# EAGLE design lun1k_v1_2 (EAGLE 6.6.0)
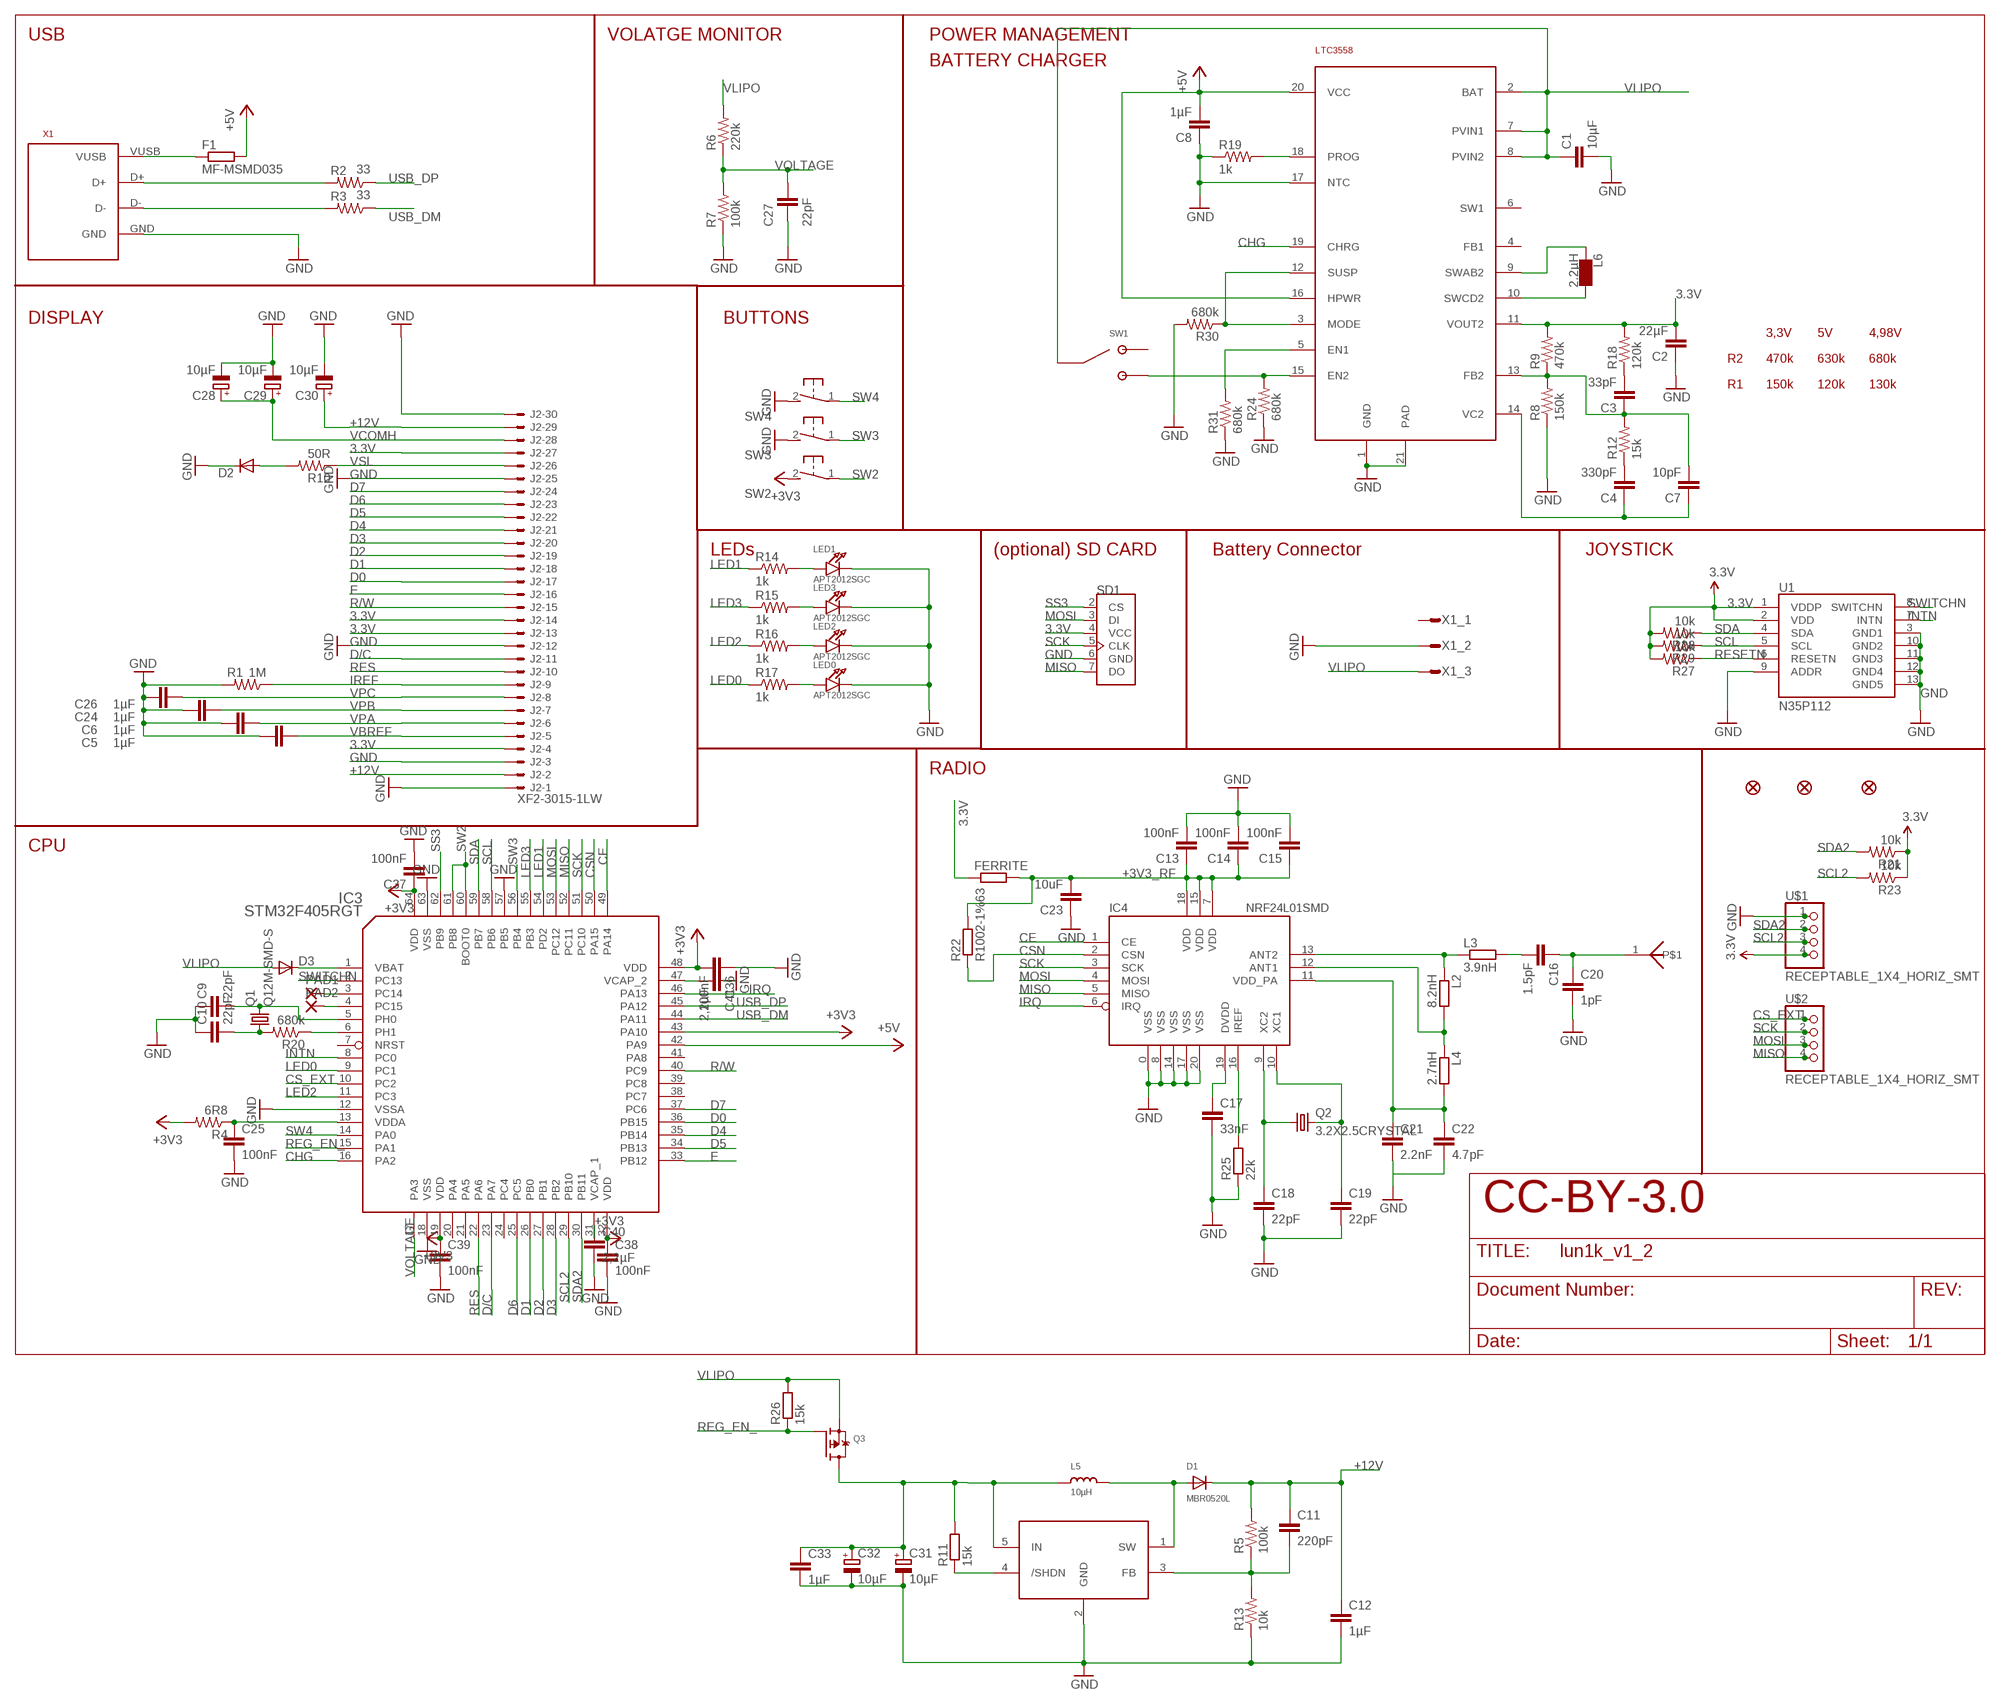
[diagram p0: schematic, sheet 1]

## Parts
ANT  CHIPANTENNA  [CHIPANTENNA]
C1  10µF  CAP0805  [0805]
C2  22µF  CAP0805  [0805]
C3  33pF  CAP0805  [0805]
C4  330pF  CAP0805  [0805]
C5  1µF  CAP0805  [0805]
C6  1µF  CAP0805  [0805]
C7  10pF  CAP0805  [0805]
C8  1µF  CAP0805  [0805]
C9  22pF  CAP0402-CAP  [0402-CAP]
C10  22pF  CAP0402-CAP  [0402-CAP]
C11  220pF  CAP0805  [0805]
C12  1µF  CAP0805  [0805]
C13  100nF  C-EUC0402K  [C0402K]
C14  100nF  C-EUC0402K  [C0402K]
C15  100nF  C-EUC0402K  [C0402K]
C16  1.5pF  C-EUC0402K  [C0402K]
C17  33nF  C-EUC0402K  [C0402K]
C18  22pF  C-EUC0402K  [C0402K]
C19  22pF  C-EUC0402K  [C0402K]
C20  1pF  C-EUC0402K  [C0402K]
C21  2.2nF  C-EUC0402K  [C0402K]
C22  4.7pF  C-EUC0402K  [C0402K]
C23  10uF  C-EUC0805K  [C0805K]
C24  1µF  CAP0805  [0805]
C25  100nF  CAP0402-CAP  [0402-CAP]
C26  1µF  CAP0805  [0805]
C27  22pF  CAP0402-CAP  [0402-CAP]
C28  10µF  CPOL-EUSMCA  [SMC_A]
C29  10µF  CPOL-EUSMCA  [SMC_A]
C30  10µF  CPOL-EUSMCA  [SMC_A]
C31  10µF  CPOL-EUSMCA  [SMC_A]
C32  10µF  CPOL-EUSMCA  [SMC_A]
C33  1µF  CAP0805  [0805]
C36  100nF  CAP0402-CAP  [0402-CAP]
C37  100nF  CAP0402-CAP  [0402-CAP]
C38  100nF  CAP0402-CAP  [0402-CAP]
C39  100nF  CAP0402-CAP  [0402-CAP]
C40  2,2µF  CAP0805  [0805]
C41  2,2µF  CAP0805  [0805]
D1  MBR0520L  DIODESOD-123  [SOD-123]
D2  DIODE-SOD323-R  [SOD323-R]
D3  DIODE-SOD323-R  [SOD323-R]
F1  MF-MSMD035  R-EU_R1210  [R1210]
FERRITE  R-EU_R0805  [R0805]
FID1  FIDUCIAL1.5X3  [FIDUCIAL-1.5X3]
FID2  FIDUCIAL1.5X3  [FIDUCIAL-1.5X3]
FID3  FIDUCIAL1.5X3  [FIDUCIAL-1.5X3]
IC1  LTC3558  [UD-QFN20]
IC2  LM27313  [SOT23-5L]
IC3  STM32F405RGT  [LQFP64]
IC4  NRF24L01SMD  [QFN20]
J2  XF2-3015-1LW  [XF2H-3015-1LW]
L2  8.2nH  R-EU_R0402  [R0402]
L3  3.9nH  R-EU_R0402  [R0402]
L4  2.7nH  R-EU_R0402  [R0402]
L5  10µH  INDUCTOR  [INDUCTOR_1007]
L6  2.2µH  CDH3D16  [CDRH3D16]
LED0  APT2012SGC  LED0805  [CHIPLED_0805]
LED1  APT2012SGC  LED0805  [CHIPLED_0805]
LED2  APT2012SGC  LED0805  [CHIPLED_0805]
LED3  APT2012SGC  LED0805  [CHIPLED_0805]
PAD1  SMD2  [SMD1,27-2,54]
PAD2  SMD2  [SMD1,27-2,54]
Q1  Q12M-SMD-S  X22-OSCILLATOR  [X22]
Q2  3.2X2.5CRYSTAL  [CRYSTAL3.2X2.5]
Q3  MOSFET-P  [SOT23-R]
R1  1M  RESISTOR0805-RES  [0805]
R2  33  RESISTOR0402-RES  [0402-RES]
R3  33  RESISTOR0402-RES  [0402-RES]
R4  6R8  RESISTOR0402-RES  [0402-RES]
R5  100k  RESISTOR0805-RES  [0805]
R6  220k  RESISTOR0402-RES  [0402-RES]
R7  100k  RESISTOR0402-RES  [0402-RES]
R8  150k  RESISTOR0805-RES  [0805]
R9  470k  RESISTOR0805-RES  [0805]
R10  50R  RESISTOR0805-RES  [0805]
R11  15k  R-EU_R0402  [R0402]
R12  15k  RESISTOR0805-RES  [0805]
R13  10k  RESISTOR0805-RES  [0805]
R14  1k  RESISTOR0402-RES  [0402-RES]
R15  1k  RESISTOR0402-RES  [0402-RES]
R16  1k  RESISTOR0402-RES  [0402-RES]
R17  1k  RESISTOR0402-RES  [0402-RES]
R18  120k  RESISTOR0805-RES  [0805]
R19  1k  RESISTOR0805-RES  [0805]
R20  680k  RESISTOR0402-RES  [0402-RES]
R21  10k  RESISTOR0402-RES  [0402-RES]
R22  R1002-1%63  R-EU_R0603  [R0603]
R23  10k  RESISTOR0402-RES  [0402-RES]
R24  680k  RESISTOR0402-RES  [0402-RES]
R25  22k  R-EU_R0603  [R0603]
R26  15k  R-EU_R0402  [R0402]
R27  10k  RESISTOR0402-RES  [0402-RES]
R28  10k  RESISTOR0402-RES  [0402-RES]
R29  10k  RESISTOR0402-RES  [0402-RES]
R30  680k  RESISTOR0402-RES  [0402-RES]
R31  680k  RESISTOR0402-RES  [0402-RES]
SD1  MICROSD_SF-MICROSD  [MICROSD_MICROSD]
SW1  JS102011SAQN  [JS102011SAQN]
SW2  SWITCH_MCTAEF  [SWITCH_MCTAEF]
SW3  SWITCH_MCTAEF  [SWITCH_MCTAEF]
SW4  SWITCH_MCTAEF  [SWITCH_MCTAEF]
U1  N35P112  [N35P112]
U$1  RECEPTABLE_1X4_HORIZ_SMT  [RECEPTABLE_1X4_HORIZ_SMT]
U$2  RECEPTABLE_1X4_HORIZ_SMT  [RECEPTABLE_1X4_HORIZ_SMT]
X1  MICROUSB  [MICROAB]
X1_  JST-PH3  [JST-PH3]

## Nets
3.3V [GND/3V3]: C2.2 C36.2 C37.1 C38.1 C39.1 FERRITE.1 IC1.11(VOUT2) IC3.19(VDD) IC3.32(VDD) IC3.43(PA10) IC3.48(VDD) IC3.64(VDD) J2.4 J2.13 J2.14 J2.27 R4.2 R9.2 R18.2 R21.1 R23.1 R27.2 R28.2 R29.2 SD1.4(VCC) SW2.2 U1.1(VDDP) U1.2(VDD) U$1.4 U$1.4@1 ; supply symbol labelled +3V3
+3V3_RF: C13.1 C14.1 C15.1 C23.2 FERRITE.2 IC4.7(VDD) IC4.15(VDD) IC4.18(VDD) R22.2
+5V [FAT]: C8.2 F1.2 IC1.16(HPWR) IC1.20(VCC) IC3.42(PA9)
+12V: C11.1 C12.1 C30.+ D1.C J2.2 J2.29 R5.2
CE: IC3.49(PA14) IC4.1(CE)
CHG: IC1.19(CHRG) IC3.16(PA2)
CS_EXT: IC3.10(PC2) U$2.1 U$2.1@1
CSN: IC3.50(PA15) IC4.2(CSN) R22.1
D0: IC3.36(PB15) J2.17
D1: IC3.26(PB0) J2.18
D2: IC3.27(PB1) J2.19
D3: IC3.28(PB2) J2.20
D4: IC3.35(PB14) J2.21
D5: IC3.34(PB13) J2.22
D6: IC3.25(PC5) J2.23
D7: IC3.37(PC6) J2.24
D+: R2.2 X1.D+
D-: R3.2 X1.D-
D/C: IC3.23(PA7) J2.11
E [GND/3V3]: IC3.33(PB12) J2.16
EN2: IC1.15(EN2) R24.2 SW1.3
GND [GND/3V3]: C1.2 C2.1 C5.1 C6.1 C8.1 C9.1 C10.1 C12.2 C13.2 C14.2 C15.2 C17.2 C18.2 C19.2 C20.2 C21.2 C22.2 C23.1 C24.1 C25.2 C26.1 C27.1 C28.- C29.- C30.- C31.- C32.- C33.2 C36.1 C37.2 C38.2 C39.2 C40.2 C41.1 D2.C IC1.1(GND) IC1.17(NTC) IC1.21(PAD) IC2.2(GND) IC3.12(VSSA) IC3.18(VSS) IC3.57(PB5) IC3.63(VSS) IC4.0(VSS) IC4.8(VSS) IC4.14(VSS) IC4.17(VSS) IC4.20(VSS) J2.1 J2.3 J2.12 J2.25 J2.30 LED0.C LED1.C LED2.C LED3.C R1.2 R7.1 R8.1 R13.1 R19.1 R24.1 R25.1 R30.2 R31.1 SD1.6(GND) SW3.2 SW4.2 U1.3(GND1) U1.9(ADDR) U1.10(GND2) U1.11(GND3) U1.12(GND4) U1.13(GND5) U$1.1 U$1.1@1 X1.GND X1_.2
INTN: IC3.8(PC0) U1.7(INTN)
IREF: J2.9 R1.1
IRQ: IC3.46(PA13) IC4.6(IRQ)
LED0: IC3.9(PC1) R17.1
LED1: IC3.54(PD2) R14.1
LED2: IC3.11(PC3) R16.1
LED3: IC3.55(PB3) R15.1
MISO: IC3.52(PC11) IC4.5(MISO) SD1.7(DO) U$2.4 U$2.4@1
MOSI: IC3.53(PC12) IC4.4(MOSI) SD1.3(DI) U$2.3 U$2.3@1
N$1: C9.2 IC3.5(PH0) Q1.3
N$2: IC1.18(PROG) R19.2
N$3: C10.2 Q1.1 R20.2
N$4: LED0.A R17.2
N$5: LED2.A R16.2
N$6: LED3.A R15.2
N$7: C3.1 C7.2 IC1.13(FB2) R8.2 R9.1 R12.2
N$8: F1.1 X1.VUSB
N$9: LED1.A R14.2
N$10: C18.1 IC4.9(XC2) Q2.1
N$11: C19.1 IC4.10(XC1) Q2.3
N$12 [GND/3V3]: ANT.1 C16.1 C20.1
N$13: C3.2 R18.1
N$14: D2.A R10.2
N$15: C25.1 IC3.13(VDDA) R4.1
N$16: C4.2 R12.1
N$17: C4.1 C7.1 IC1.14(VC2)
N$18: IC1.10(SWCD2) L6.P$1
N$19: C40.1 IC3.31(VCAP_1)
N$20: C41.2 IC3.47(VCAP_2)
N$21: IC3.3(PC14) PAD1.1(P)
N$22: IC1.9(SWAB2) L6.P$2
N$23: IC3.4(PC15) PAD2.1(P)
N$24: D1.A IC2.1(SW) L5.P$2
N$25: IC1.3(MODE) IC1.12(SUSP) R30.1
N$26: C11.2 IC2.3(FB) R5.1 R13.2
N$27: IC1.5(EN1) R31.2
N$28: IC3.6(PH1) R20.1
N$29: D3.C IC3.1(VBAT)
N$30: IC2.4(/SHDN) R11.1
N$70: C17.1 IC4.19(DVDD)
N$71: IC4.16(IREF) R25.2
N$73: C21.1 C22.1 IC4.11(VDD_PA) L4.2
N$78: IC4.12(ANT1) L2.2 L4.1
N$79: IC4.13(ANT2) L2.1 L3.1
N$80: C16.2 L3.2
R/W [GND/3V3]: IC3.40(PC9) J2.15
REG_EN_: IC3.15(PA1) Q3.1(G) R26.1
RES: IC3.22(PA6) J2.10
RESETN: R27.1 U1.6(RESETN)
SCK: IC3.51(PC10) IC4.3(SCK) SD1.5(CLK) U$2.2 U$2.2@1
SCL: IC3.58(PB6) R29.1 U1.5(SCL)
SCL2: IC3.29(PB10) R23.2 U$1.3 U$1.3@1
SDA: IC3.59(PB7) R28.1 U1.4(SDA)
SDA2: IC3.30(PB11) R21.2 U$1.2 U$1.2@1
SS3: IC3.62(PB9) SD1.2(CS)
SW2: IC3.60(BOOT0) IC3.61(PB8) SW2.1
SW3: IC3.56(PB4) SW3.1
SW4: IC3.14(PA0) SW4.1
SWITCHN: IC3.2(PC13) U1.8(SWITCHN)
USB_DM: IC3.44(PA11) R3.1
USB_DP: IC3.45(PA12) R2.1
VBREF: C5.2 J2.5
VCOMH: C28.+ C29.+ J2.28
VLIPO: C1.1 D3.A IC1.2(BAT) IC1.7(PVIN1) IC1.8(PVIN2) Q3.2(S) R6.2 R26.2 SW1.2 X1_.3
VOLTAGE: C27.2 IC3.17(PA3) R6.1 R7.2
VPA: C6.2 J2.6
VPB: C24.2 J2.7
VPC: C26.2 J2.8
VREGIN: C31.+ C32.+ C33.1 IC2.5(IN) L5.P$1 Q3.3(D) R11.2
VSL: J2.26 R10.1
Unconnected: IC1.4(FB1) IC1.6(SW1) IC3.7(NRST) IC3.20(PA4) IC3.21(PA5) IC3.24(PC4) IC3.38(PC7) IC3.39(PC8) IC3.41(PA8) SW1.1 X1_.1

## Notes on the sheet
- USB | VOLATGE MONITOR | POWER MANAGEMENT
- BATTERY CHARGER
- DISPLAY | BUTTONS
- 3,3V | 5V | 4,98V
- R2 | 470k | 630k | 680k
- R1 | 150k | 120k | 130k
- LEDs | (optional) SD CARD | Battery Connector | JOYSTICK
- RADIO
- CPU
- CC-BY-3.0

## Library data of the parts
ANT = badge:CHIPANTENNA
C1-C8 C11 C12 C24 C26 C33 C40 C41 = SparkFun:CAP: Capacitor Standard 0603 ceramic capacitor, and 0.1" leaded capacitor.
C9 C10 C25 C27 C36-C39 = SparkFun-Capacitors:CAP: Capacitor Standard 0603 ceramic capacitor, and 0.1" leaded capacitor.
C13-C23 = rcl:C-EU: CAPACITOR, European symbol
C28-C32 = rcl:CPOL-EU: POLARIZED CAPACITOR, European symbol
D1 = microbuilder:DIODE: Diode SMA Model Volts Amps Type Vf Vr Digikey # Notes SSA34-E3 40V 3A Schottky 480mV @ 3A 200uA @ 40V SSA34-E3/61TGITR-ND CDBA120-G 20V 1A Schottky 500mV @ 1A 500uA @ 20V 641-1014-6-ND REEL MBRA210 10V 2A Schottky 350mV @ 2A 700uA @ 10V MBRA210LT3 SOD-123 Model Volts Amps Type Vf Vr Order # Notes BAT54T1G 30V 200mA Schottky 800mV @ 200mA 2uA @ 25V BAT54T1GOSTR-ND B0530W 30V 500mA Schottky 430mV @ 500mA 130uA @ 30V B0530W-FDICT-ND REEL MBR120 1A 20V Schottky 340mV @ 1A MBR120VLSFT1GOSCT-ND SOD-323 Model Volts Amps Type Vf Vr Order # Notes PMEG2005EJ 20V 500mA Schottky 355mV @ 500mA 568-4110-1-ND ZLLS410 10V 570mA Schottky 380mV @ 570mA ZLLS410CT-ND 1N4148WS 75V 150mA Silicon/Simple 1V 1N4148WSFSCT-ND REEL SOD-523 Model Volts Amps Type Vf Vr Order # Notes BAT54XV2 30V 200mA Schottky 0.8V @ 100mA BAT54XV2CT-ND TB751S 30V 30mA Schottky RB751S-40TE61CT-ND SOT23-R/W (R = Solder Paste/Reflow Ovens, W = Hand-Soldering) Model Volts Amps Type Vf Vr Order # Notes BAT54FILM 40V 300mA Schottky 497-7162-1-ND
D2 D3 = diode:DIODE-: DIODE
F1 FERRITE L2-L4 R11 R22 R25 R26 = rcl:R-EU_: RESISTOR, European symbol
FID1-FID3 = SparkFun:FIDUCIAL: Fiducial Alignment Points Various fiducial points for machine vision alignment.
IC1 = seb:LTC3558
IC2 = seb:LM27313
IC3 = stm32:STM32F405R*T: STM32F405R*T ARM Cortex-M4 32b MCU+FPU, 210DMIPS, up to 1MB Flash/192+4KB RAM, USB OTG HS/FS, 17 TIMs, 3 ADCs, 15 comm.
IC4 = SparkFun:NRF24L01: 2.4GHz Low Power Transceiver This is the very popular, low cost, very low power RF transceiver from Nordic Semiconductor. Simple SPI interface. SKU: COM-00690
J2 = con-omron:XF2*-30?: OMRON FPC Connector Source : http://www.omron.com/ecb/products/pdf/fpc.pdf; OC_FARNELL: 1112560; OC_NEWARK: unknown
L5 = microbuilder:INDUCTOR: Inductors 0603: 10nH Ceramic Inductor - microwire antenna/RF (Digikey: 712-1434-2-ND) 0805: 560nH Ceramic Inductor - RF (Digikey: 553-1047-1-ND) 270nH Ceramic Inductor - Q = 40@250MHz, +-5%, 1 Ohm DC Resistance (Digikey: 535-10506-2-ND) 1007 (2518 Metric) SMT: 10µH 10% 250mOhm 820mA 1007 Inductor (Digikey: 587-2189-1-ND) 22µH 10% 500mOhm 580mA 1007 Inductor (Digikey: 587-2190-1-ND) 47µH 10% 950mOhm 420mA 1007 Inductor (Digikey: 587-2191-1-ND) 47µH 5% 100mOhm 1A 1008 Inductor (Digikey: 732-1816-1-ND) 5.0x5.0mm (Taiyo Yuden NR5040 Series) 6.8µH 20% 2.3A 64mOhm Inductor (Digikey: 587-2374-2-ND) 5.0x5.0mm (TDK VLC5045 Series) 4.7µH 20% 3.3A 34mOhm Inductor (Digikey: 445-6526-1-ND) 6.8µH 20% 2.7A 46mOhm Inductor (Digikey: 445-6527-1-ND) 6.0x6.0mm (TDK VLC6045 Series) 4.7µH 20% 3.8A 27mOhm Inductor (Digikey: 445-6538-2-ND) 6.8µH 20% 3A 41mOhm Inductor (Digikey: 445-6540-1-ND) 6.2µH 30% 2.2A 45mOhm Inductor (Digikey: SRR5028-6R2YCT-ND) - Not TDK VLC6045 but footprint should match 6.0x6.0mm (TDK SLF6045 Series) 6.8uH 30% 2A 33mOhm Inductor (Digikey: 445-4572-1-ND, Mouser: 810-SLF645T6R8N2R0PF)
L6 = seb:CDH3D16
LED0 LED1-LED3 = microbuilder:LED: LED 0603 - 0603 Surface Mount Package 2mA: Green LED - Low Power (3.9mcd, 2ma, 1.7Vf) - Digikey: 475-2709-2-ND Orange LED - Low Power (9.8mcd, 2ma, 1.8Vf) - Digikey: 475-1194-2-ND Red LED - Low Power (5mcd, 2ma, 1.8Vf) - Digikey: 475-1195-2-ND Yellow LED - Low Power (7mcd, 2ma, 1.8Vf) - Digikey: 475-1196-2-ND 5mA: Blue LED - Low Power (17mcd, 5ma, 2.9Vf) - Digikey: LNJ937W8CRACT-ND 0805 - 0805 Surface Mount Package 2mA: Red LED (8.8mcd, 2mA, 1.8Vf, Clear) - Low Power [Digikey: 475-2510-1-ND] Green LED (5mcd, 2mA, 1.8Vf, Clear) - Low Power [Digikey: 475-2730-1-ND] Yellow LED (11.3mcd, 2mA, 1.8Vf, Clear) - Low Power [Digikey: 475-2555-1-ND] 20mA: Red LED (104mcd, 20mA, Diffused) - LS R976 [Digikey: 475-1278-6-ND] Red LED (12mcd, 20mA, 2.0Vf, Clear) - APT2012EC [Digikey: 754-1128-1-ND] Green LED (15mcd, 20mA, 2.2Vf, Clear) - APT2012GC [Digikey: 754-1131-1-ND] Orange LED (160mcd, 20mA, 2.1Vf, Clear) - APT2012SECK [Digikey: 754-1130-1-ND] 1206 - 1206 Surface Mount Package Green LED (26mcd, 20mA, Diffused) - LG N971 [Digikey: 475-1407-6-ND] Red LED (15mcd, 20mA, Diffused) - LH N974 [Digikey: 475-1416-6-ND]
PAD1 PAD2 = wirepad:SMD2: SMD PAD
Q1 = seb:X22-OSCILLATOR
Q2 = badge:3.2X2.5CRYSTAL
Q3 = microbuilder:MOSFET-P: P-Channel Mosfet LEGEND VDS: Voltage Drain-Source ID: Drain Current RDS(ON): Drain-Source On-State Resistance VGS(TH): Gate-Source Threshold Voltage CISS: Drain-Source Input Capacitance SOT-23 Name VDS ID RDS(ON) VGS(TH) CISS Order Number IRLML5103 30V 760mA 600 mOhm -- 75pF @ 25V Digikey: IRLML5103PBFCT-ND IRLML6401 12V 4.3A 50 mOhm 950mV @ 250µA 830pF @ 10V Digikey: IRLML6401PBFTR-ND NTR0202PL 20V 400mA 800 mOhm 2.3V @ 250uA 70pF @ 5V Digikey: NTR0202PLT1GOSTR-ND NTR4101PT1G 20V 1.8A 85 mOhm 1.2V @ 250uA 675pF @ 10V Digikey: NTR4101PT1GOSCT-ND DMP2004K 20V 600mA 900 mOhm 1V @ 250uA 175pF @ 16V Digikey: DMP2004KDICT-ND PMV65XP 20V 3.9A 76 mOhm 950mV @ 1mA 725pF @ 20V Digikey: 568-2358-2-ND TO-252 Name VDS ID RDS(ON) VGS(TH) CISS Order Number AOD417 30V 25A 34 mOhm 3V @ 250µA 920pF @ 15V Digikey: 785-1106-2-ND
R1 R5 R10 R13 R21 R23 R27-R29 = SparkFun:RESISTOR: Resistor Basic schematic elements and footprints for 0603, 1206, and PTH resistors.
R2 R3 R6 R7 R14-R17 = SparkFun-Passives:RESISTOR: Resistor Basic schematic elements and footprints for 0603, 1206, and PTH resistors.
R4 R8 R9 R12 R18-R20 R24 R30 R31 = SparkFun-Resistors:RESISTOR: Resistor Basic schematic elements and footprints for 0603, 1206, and PTH resistors.
SD1 = sd:MICROSD_SF-MICROSD
SW1 = badge:JS102011SAQN
SW2-SW4 = seb:SWITCH_MCTAEF
U1 = miscellany:N35P112
U$1 U$2 = seb:RECEPTABLE_1X4_HORIZ_SMT
X1 = badge:MICROUSB
X1_ = badge:JST-PH3

## Net classes
1 FAT: width 0.2 mm, drill 0.4 mm
2 GND/3V3: width 0.2 mm, drill 0.4 mm

## Board
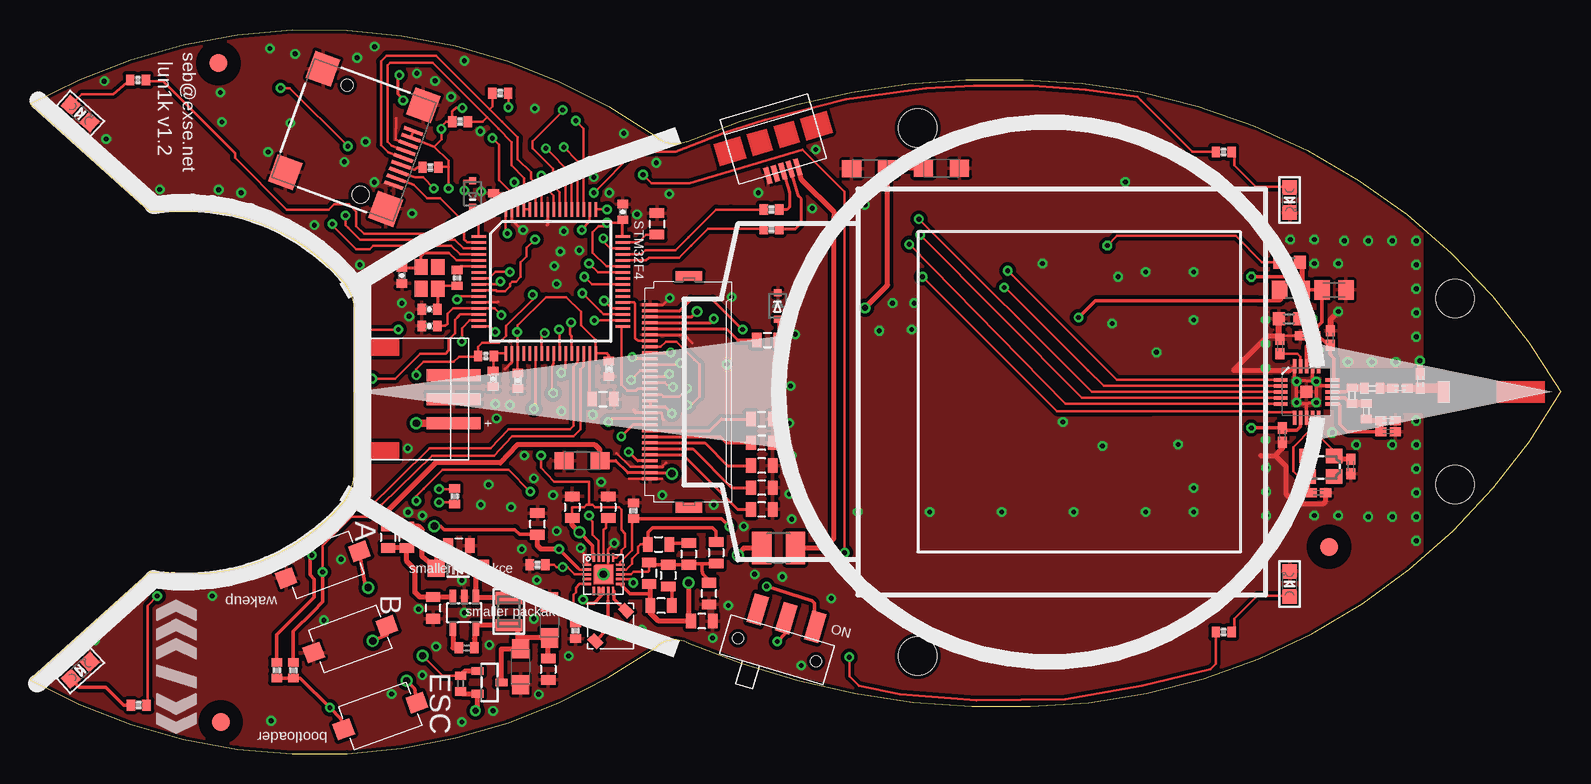
[diagram p1: board, top side]
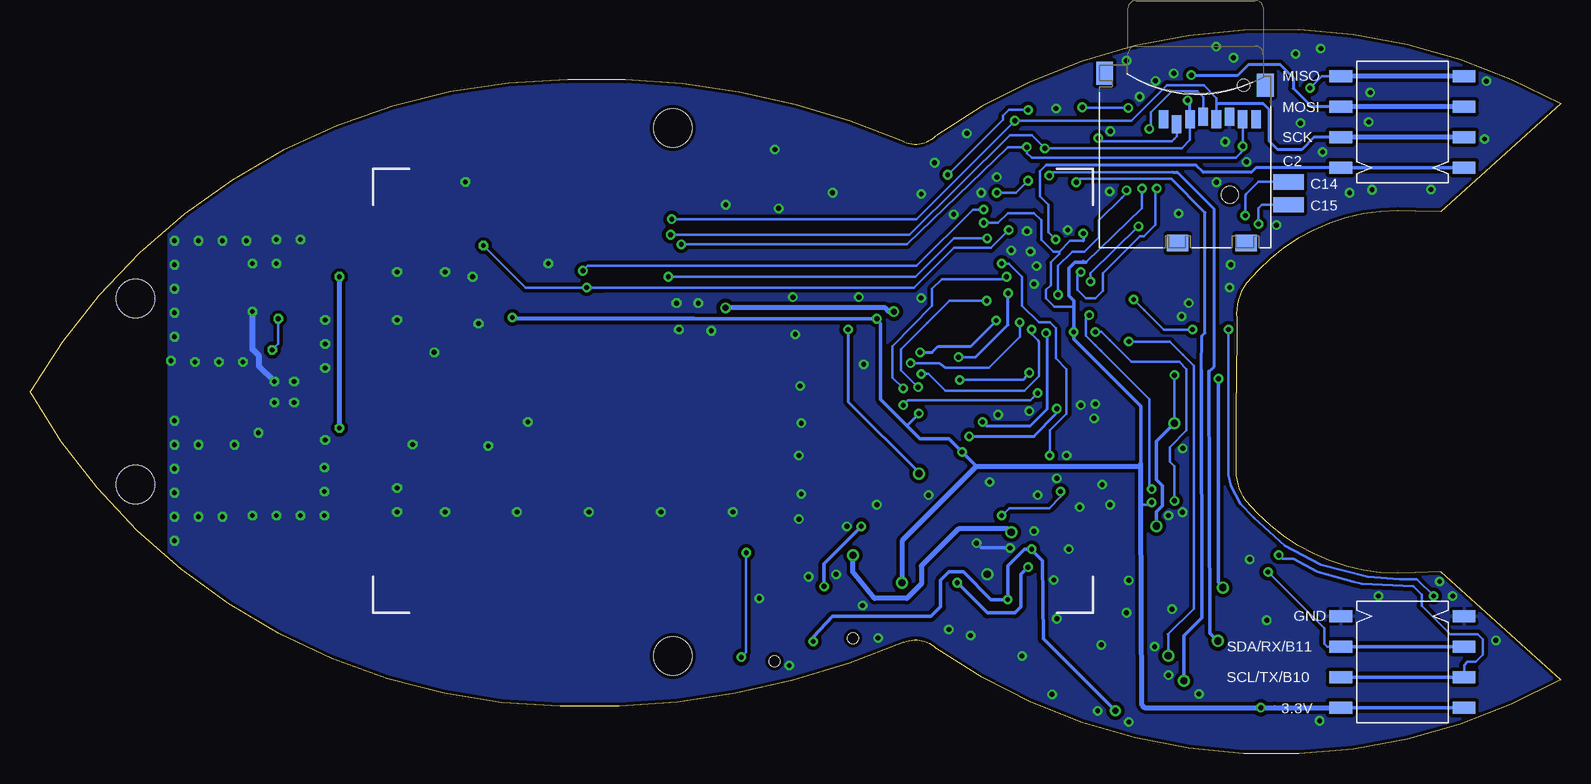
[diagram p2: board, bottom side, seen from below]

Size 127.6 x 60.33 mm. Coordinates in mm from the lower left corner, seen from the top.
Outline: 0,54.16 arc-64 52.1,51.51 arc62 54.52,50.93 54.73,51.02 arc-25 82.8,56.16 arc-59 127.6,30.16 arc-59 83.4,3.96 arc-25 54.73,9.3 54.52,9.39 arc62 52.1,8.81 arc-64 0,6.16 10,15.16 12.14,15.09 arc55 26.23,21.11 arc41 27.02,24 27.02,30.11 27.01,36.31 arc41 26.22,39.2 arc55 12.13,45.22 10,45.16 0,54.16
Copper layers (1*16): Top 0.035mm / dielectric 1.5mm / Bottom 0.035mm
Design rules "default": minimum track width 0.2mm, minimum drill 0.4mm, track to track 0.2mm, track to pad 6mil, pad to pad 6mil, via to via 0.2mm, smd to smd 6mil, copper to edge 0.2mm, drill to drill 8mil, minimum pad ring 8mil, minimum via ring 0.2mm, stop-mask expansion 4mil, vias tented up to drill 2.8mm, thermal gap 10mil
Holes 3.2 mm at 118.8,37.96 74,8.16 74,52.16 118.8,22.46
tRestrict: area 14.5,1.2 to 17.3,4.1; area 14.3,56.1 to 17.1,59; area 106.9,15.8 to 109.7,18.7

### Footprints (pad centres in the part's own frame; a part is rotated, then mirrored left to right if it is on the bottom)
CHIPANTENNA = smd 1 x 1.8: 1 -2.45,0
0805 = smd 0.8 x 1.2: 1 -0.9,0; 2 0.9,0
0402-CAP = smd 0.7 x 0.9: 1 -0.65,0; 2 0.65,0
C0402K = smd 0.925 x 0.74: 1 -0.6,0; 2 0.6,0
C0805K = smd 1.3 x 1.6: 1 -1,0; 2 1,0
SMC_A = smd 1.6 x 1.4: + -1.5,0; - 1.5,0
SOD-123 = smd 1.4 x 1.4: A 1.85,0; C -1.85,0
SOD323-R = smd 0.6 x 0.6: A 1.1,0; C -1.1,0
R1210 = smd 1.6 x 2.7: 1 -1.4,0; 2 1.4,0
R0805 = smd 1.3 x 1.5: 1 -0.95,0; 2 0.95,0
FIDUCIAL-1.5X3 = smd 1.5 x 1.5: 1 0,0
UD-QFN20 = smd 0.7 x 0.2: 1 -1.4,0.8; 2 -1.4,0.4; 3 -1.4,0; 4 -1.4,-0.4; 5 -1.4,-0.8; 11 1.4,-0.8; 12 1.4,-0.4; 13 1.4,0; 14 1.4,0.4; 15 1.4,0.8 | smd 0.2 x 0.7: 6 -0.8,-1.4; 7 -0.4,-1.4; 8 0,-1.4; 9 0.4,-1.4; 10 0.8,-1.4; 16 0.8,1.4; 17 0.4,1.4; 18 0,1.4; 19 -0.4,1.4; 20 -0.8,1.4 | smd 1.5 x 1.5: 21 0,0
SOT23-5L = smd 0.55 x 1.2: 1 -0.95,-1.3; 2 0,-1.3; 3 0.95,-1.3; 4 0.95,1.3; 5 -0.95,1.3
LQFP64 = smd 0.24 x 1.2: 1 -3.75,-6; 2 -3.25,-6; 3 -2.75,-6; 4 -2.25,-6; 5 -1.75,-6; 6 -1.25,-6; 7 -0.75,-6; 8 -0.25,-6; 9 0.25,-6; 10 0.75,-6; 11 1.25,-6; 12 1.75,-6; 13 2.25,-6; 14 2.75,-6; 15 3.25,-6; 16 3.75,-6; 33 3.75,6; 34 3.25,6; 35 2.75,6; 36 2.25,6; 37 1.75,6; 38 1.25,6; 39 0.75,6; 40 0.25,6; 41 -0.25,6; 42 -0.75,6; 43 -1.25,6; 44 -1.75,6; 45 -2.25,6; 46 -2.75,6; 47 -3.25,6; 48 -3.75,6 | smd 1.2 x 0.24: 17 6,-3.75; 18 6,-3.25; 19 6,-2.75; 20 6,-2.25; 21 6,-1.75; 22 6,-1.25; 23 6,-0.75; 24 6,-0.25; 25 6,0.25; 26 6,0.75; 27 6,1.25; 28 6,1.75; 29 6,2.25; 30 6,2.75; 31 6,3.25; 32 6,3.75; 49 -6,3.75; 50 -6,3.25; 51 -6,2.75; 52 -6,2.25; 53 -6,1.75; 54 -6,1.25; 55 -6,0.75; 56 -6,0.25; 57 -6,-0.25; 58 -6,-0.75; 59 -6,-1.25; 60 -6,-1.75; 61 -6,-2.25; 62 -6,-2.75; 63 -6,-3.25; 64 -6,-3.75
QFN20 = smd 1 x 1: 0 0,0 | smd 1.158 x 0.3: 1 -2.154,1; 2 -2.154,0.5; 3 -2.154,0; 4 -2.154,-0.5; 5 -2.154,-1; 11 2.154,-1; 12 2.154,-0.5; 13 2.154,0; 14 2.154,0.5; 15 2.154,1 | smd 0.3 x 1.158: 6 -1,-2.154; 7 -0.5,-2.154; 8 0,-2.154; 9 0.5,-2.154; 10 1,-2.154; 16 1,2.154; 17 0.5,2.154; 18 0,2.154; 19 -0.5,2.154; 20 -1,2.154
XF2H-3015-1LW = smd 1.3 x 0.25: 1 3.175,7.25; 2 3.175,6.75; 3 3.175,6.25; 4 3.175,5.75; 5 3.175,5.25; 6 3.175,4.75; 7 3.175,4.25; 8 3.175,3.75; 9 3.175,3.25; 10 3.175,2.75; 11 3.175,2.25; 12 3.175,1.75; 13 3.175,1.25; 14 3.175,0.75; 15 3.175,0.25; 16 3.175,-0.25; 17 3.175,-0.75; 18 3.175,-1.25; 19 3.175,-1.75; 20 3.175,-2.25; 21 3.175,-2.75; 22 3.175,-3.25; 23 3.175,-3.75; 24 3.175,-4.25; 25 3.175,-4.75; 26 3.175,-5.25; 27 3.175,-5.75; 28 3.175,-6.25; 29 3.175,-6.75; 30 3.175,-7.25 | smd 2.2 x 0.8: M1 -0.075,9.65; M2 -0.075,-9.65
R0402 = smd 0.7 x 0.9: 1 -0.65,0; 2 0.65,0
INDUCTOR_1007 = smd 1.016 x 2.2: P$1 -1.127,0; P$2 1.127,0
CDRH3D16 = smd 1.1 x 0.8: P$1 0,-1.8; P$2 0,1.8
CHIPLED_0805 = smd 1.2 x 1.2: A 0,-1.05; C 0,1.05
SMD1,27-2,54 = smd 1.27 x 2.54: 1 0,0
X22 = smd 1.3 x 1.1: 1 0.9,0.7; 2 -0.9,0.7; 3 -0.9,-0.7; 4 0.9,-0.7
CRYSTAL3.2X2.5 = smd 1.4 x 1.2: 1 -1.1,-0.85; 2 1.1,-0.85; 3 1.1,0.85; 4 -1.1,0.85
SOT23-R = smd 0.635 x 1.016: 1 -0.95,-1; 2 0.95,-1; 3 0,1
0402-RES = smd 0.7 x 0.9: 1 -0.65,0; 2 0.65,0
R0603 = smd 1 x 1.1: 1 -0.85,0; 2 0.85,0
MICROSD_MICROSD = smd 0.8 x 1.5: 1 -1.94,2.7; 2 -0.84,2.3; 3 0.26,2.7; 4 1.36,2.9; 5 2.46,2.7; 6 3.56,2.9; 7 4.66,2.7; 8 5.76,2.7 | smd 1.4 x 1.9: NC -6.85,6.55; NC3 6.55,5.55 | smd 1.8 x 1.4: NC1 -0.75,-7.6; NC2 4.95,-7.6
JS102011SAQN = smd 1.2 x 2.5: 1 -2.5,2.75; 2 0,2.75; 3 2.5,2.75 | hole 0.9: 3.4,0; -3.4,0
SWITCH_MCTAEF = smd 1.5 x 1.4: 1 -3.25,0; 2 3.25,0
N35P112 = smd 1.65 x 0.3: 1 -4.4,-2.4; 2 -4.4,-1.8; 3 -4.4,-1.2; 4 -4.4,-0.6; 5 -4.4,0; 6 -4.4,0.6; 7 -4.4,1.2; 8 -4.4,1.8; 9 -4.4,2.4 | smd 2.2 x 2.4: 10 -4.45,4.5; 11 4.45,4.5; 12 4.45,-4.7; 13 -4.45,-4.7 | hole 1.4: -2.1,4.1 | hole 1: 2.1,-4.1
RECEPTABLE_1X4_HORIZ_SMT = smd 1.016 x 1.905: 1 -3.81,-5.144; 1@1 -3.81,5.144; 2 -1.27,-5.144; 2@1 -1.27,5.144; 3 1.27,-5.144; 3@1 1.27,5.144; 4 3.81,-5.144; 4@1 3.81,5.144
MICROAB = smd 0.4 x 1.4: D+ 0,0; D- -0.65,0; GND 1.3,0; KEY 0.65,0; VUSB -1.3,0
JST-PH3 = smd 1 x 4.5: 1 2,0; 2 0,0; 3 -2,0

### Placement (x,y rotation side)
ANT  120.3,30.16 0 top
C1  42.3,19.16 90 top
C2  56,11.06 180 top
C3  53.2,14.86 270 top
C4  52.4,17.46 0 top
C5  61,20.37 180 top
C6  61,22.18 180 top
C7  57.2,16.76 270 top
C8  45.2,20.56 270 top
C9  31,39.86 90 top
C10  33.3,37.06 0 top
C11  29.85,18.06 270 top
C12  35.75,17.36 0 top
C13  106.5,34.86 180 top
C14  108.4,34.66 90 top
C15  104.4,26.56 270 top
C16  114.2,30.46 180 top
C17  104.2,33.96 90 top
C18  107.4,21.76 0 top
C19  110.1,23.96 270 top
C20  115.9,31.06 90 top
C21  113.2,27.76 0 top
C22  113.2,26.86 0 top
C23  108.7,38.66 180 top
C24  61,24.03 180 top
C25  33.3,35.66 180 top
C26  61,25.93 180 top
C27  38.6,31.26 90 top
C28  69.99,48.76 180 top
C29  75.98,48.8 0 top
C30  46.01,24.44 180 top
C31  40.9,7.26 270 top
C32  43.3,11.16 90 top
C33  43.2,7.06 270 top
C36  49.41,45.17 270 top
C37  38.66,46.07 90 top
C38  48.25,32.09 270 top
C39  40.66,31.1 270 top
C40  47.77,29.57 0 top
C41  52.27,44.17 270 top
D1  35.7,15.46 0 top
D2  62.34,37.33 270 top
D3  36.9,46.66 90 top
F1  62.4,17.16 180 top
FERRITE  105.1,38.66 0 top
FID1  15.9,2.66 0 top
FID2  108.3,17.26 0 top
FID3  15.7,57.56 0 top
IC1  47.8,14.96 0 top
IC2  36.2,11.76 180 top
IC3  43.41,39.37 270 top
IC4  106.4,30.16 0 top
J2  54.85,30.16 180 top
L2  110.2,29.86 270 top
L3  111.9,30.46 0 top
L4  111.4,28.56 270 top
L5  39.9,11.86 90 top
L6  48.4,10.66 135 top
LED0  4.19,53.36 228 top
LED1  105,46.16 180 top
LED2  4.19,6.96 312 top
LED3  105,14.16 0 top
PAD1  22.7,47.66 90 bottom
PAD2  22.7,45.76 270 bottom
Q1  33.3,39.66 270 top
Q2  107.6,23.96 0 top
Q3  38.3,5.96 270 top
R1  61,27.9 0 top
R2  61.8,45.36 0 top
R3  61.8,43.76 0 top
R4  35.4,21.46 270 top
R5  31.4,18.06 90 top
R6  38,33.16 180 top
R7  38.6,31.26 90 top
R8  56.6,13.36 90 top
R9  51.6,15.06 270 top
R10  61.48,34.5 0 top
R11  36.4,8.84 0 top
R12  54.9,16.66 270 top
R13  33.6,12.16 90 top
R14  99.5,50.16 0 top
R15  99.5,10.16 0 top
R16  9.07,4.06 180 top
R17  9,56.16 180 top
R18  52.6,12.36 180 top
R19  48.2,20.56 270 top
R20  35.6,39.66 270 top
R21  21.95,6.96 90 top
R22  105,40.96 0 top
R23  20.57,6.96 90 top
R24  50.3,20.26 270 top
R25  104.95,36.26 0 top
R26  35.9,5.86 270 top
R27  33.38,48.89 0 top
R28  35.85,52.69 180 top
R29  39.2,55.06 0 top
R30  42.3,15.76 180 top
R31  45.48,10.26 90 top
SD1  31.17,50.19 0 bottom
SW1  62.27,8.68 343.3 top
SW2  29.2,3.16 200 top
SW3  26.7,9.56 200 top
SW4  24.4,15.76 200 top
U1  27,51.16 160 top
U$1  13.2,7.66 270 bottom
U$2  13.2,52.66 90 bottom
X1  62.76,48.56 196.5 top
X1_  35.3,29.56 90 top

### Tracks (layer width: path | path; a pad name or v marks a point on that pad's centre or on a via)
3.3V  (via drill 0.4, 0.6)
  Top 0.203: IC1.11 49.3,14.06 | v34.9,47.11 34.9,48.91 | 34.9,48.91 34.9,49.41 33.7,50.61 U1.2 | R27.2 34.05,48.91 34.9,48.91
  Top 0.229: 39.61,45.42 IC3.64 39.66,43.53 v39.8,43.36 | 48.09,33.37 IC3.32 47.16,34.53 45.95,35.74 45.95,36.84 44.7,38.06 43,38.06 40.66,35.73 40.66,35.16 | 40.66,35.16 IC3.19 C39.1 | v40.6,35.16 40.66,35.16 | IC3.48 49.41,44.26 v48.1,44.26 47.8,43.96 47.4,43.96 46.9,43.46 46.9,41.76 48.04,40.62 IC3.43 | R4.2 35.25,20.96 v34.1,20.96 | U1.1 U1.2 | 33.7,50.61 34.3,51.21 v34.3,52.09 34.3,52.31 34.67,52.69 R28.2 35.2,53.54 35.5,53.84 v36.05,53.84 | v39.88,53.89 39.88,55.04 R29.2
  Top 0.254: IC3.48 C36.2 | C37.1 39.61,45.42 | 48.09,33.37 48.25,33.22 C38.1 | J2.4 50.65,24.41 v49.9,25.16 | J2.14 J2.13 52.95,28.91 v53.5,28.36 | J2.27 56.75,35.91 v57,36.26
  Top 0.279: SW2.2 25.95,2.91 v25,3.85 22.54,6.31 R21.1 R23.1
  Top 0.3: 102.4,37.76 104.2,37.76 104.3,37.86 104.3,38.66 FERRITE.1
  Top 0.305: 102.4,37.76 88.8,37.76 v87.4,36.36 | R18.2 51.9,12.16 | R9.2 51.7,14.06 | 49.3,14.06 50,13.36 51.7,13.36
  Top 0.406: 51.7,14.06 51.7,13.36 R18.2 51.7,11.76 52.4,11.06 C2.2 54.9,10.76 v54.9,14.26
  Bottom 0.203: v34.1,20.96 34.3,20.76 35,20.76 | 34.9,45.46 v34.9,47.11
  Bottom 0.229: 34.9,45.46 39.6,40.96 | v48.1,44.26 46.9,44.26 46.1,45.06 43.9,45.06 43.3,44.46 43.3,42.86 42.3,41.86 41.8,41.86 | 41.8,41.86 40.9,42.76 39.8,42.76 | 41.8,41.86 41.8,41.66 42.5,40.96 42.5,39.06 42.9,38.66 42.9,37.96 42.2,37.26 40.6,37.26 | SD1.4 29.81,54.72 30.3,55.21 32.42,55.21 34.15,53.49 34.15,52.24 v34.3,52.09 | v36.05,53.84 39.83,53.84 v39.88,53.89
  Bottom 0.254: v53.5,28.36 54.5,27.36 | v39.8,43.36 39.8,42.76 | 39.8,41.06 39.9,40.96
  Bottom 0.305: v87.4,36.36 v57,36.26 | v57,36.26 56.7,35.86 56.7,29.56 54.5,27.36 53.4,26.26 51,26.26 v49.9,25.16 48.7,23.96 | 35.2,23.96 35,24.16 35,28.96 40.6,34.56 v40.6,35.16 40.6,37.26 40.6,37.76 41,38.16 41,40.46 40.5,40.96 39.9,40.96 39.6,40.96 | U$1.4@1 U$1.4 18.4,3.8 | 87.2,36.26 v57,36.26
  Bottom 0.406: 35,24.16 35,20.76 34.9,4.06 34.69,3.85 v25,3.85 23.85,3.85 U$1.4 | 35.2,23.96 48.7,23.96 54.9,17.76 v54.9,14.26
+3V3_RF  (via drill 0.4)
  Top 0.2: 107.1,34.66 C13.1 107.4,34.86 | 108.7,31.31 IC4.15 | 108,34.26 108.1,34.26 108.3,34.06 C14.1 | C15.1 104.6,26.96
  Top 0.3: 107.1,34.66 106.4,33.96 IC4.18 | C14.1 108.4,33.26 108.7,32.96 108.7,31.31 | 107.4,34.86 108,34.26 | 104.6,26.96 105.6,26.96 105.9,27.26 IC4.7 | C13.1 107.1,35.36 107.7,35.96 C23.2 FERRITE.2 106.1,38.71 106.1,39.36 105.7,39.76 v101.8,39.76 | v101.8,27.16 C15.1
  Top 0.4: R22.2 106.05,40.76 FERRITE.2
  Bottom 0.4: v101.8,27.16 v101.8,39.76
+5V  (via drill 0.4, 0.6)
  Top 0.203: IC1.16 48.9,16.36 49.3,16.76 49.3,16.96 49.6,17.26 49.6,18.36 49.3,18.66 49.3,20.36 49.1,20.56 47.1,20.56 46.9,20.76 46.7,20.76 | IC1.20 46.9,16.36 | C8.2 45.2,20.56 46.2,20.56 46.4,20.76 46.7,20.76 | 43.7,22.66 46.6,22.66 46.6,20.76 46.7,20.76
  Top 0.229: IC3.42 47.34,40.12 v46.6,40.86 | v42.6,24.86 42.6,23.86 43.7,22.66
  Top 0.305: 46.9,16.36 46.9,17.36 v45.8,18.46
  Top 0.406: v45.8,18.46 45.2,19.06 C8.2 | v59,16.56 59.5,17.16 F1.2
  Bottom 0.229: v46.6,40.86 46,40.86 44.9,39.76 44.9,37.86 44.9,37.36 43.5,35.96 42.6,35.96 42.1,35.46 42.1,32.96 41.2,32.06 41.2,28.36 42.6,26.96 v42.6,24.86
  Bottom 0.406: v45.8,18.46 46.1,18.76 50.2,18.76 53.3,15.66 53.3,14.16 54.5,12.96 57.2,12.96 59,15.16 v59,16.56
+12V  (via drill 0.4, 0.6)
  Top 0.254: C30.+ 48.82,24.44 49.85,23.41 J2.2 53.45,23.41 v53.5,23.36 | J2.29 54.15,36.91 55.1,37.86 56.9,37.86 v59.4,35.36
  Top 0.305: C12.1 34.08,17.36 33.85,17.14 D1.C
  Top 0.406: D1.C 32.7,16.41 32.7,18.66 32.4,18.96 R5.2 C11.1 29.85,20.29 33.8,24.26 39.2,24.26 40.6,25.76 47.1,25.76 47.51,25.35 C30.+
  Bottom 0.254: v59.4,35.36 59.4,29.36 53.5,23.46 v53.5,23.36
CE  (via drill 0.4)
  Top 0.2: 91.4,31.16 IC4.1
  Top 0.229: IC3.49 v48.09,45.37 v48.1,45.36 | v81.5,40.26 90.6,31.16 91.4,31.16
  Bottom 0.229: v48.1,45.36 49,45.36 53.7,40.66 81.1,40.66 v81.5,40.26
CHG  (via drill 0.4)
  Top 0.203: IC1.19 47.4,17.76 46.9,18.26 46.9,19.36 46.7,19.56
  Top 0.229: 46.7,19.56 46.6,19.66 v46.6,19.86 | v41.7,21.86 39.9,23.66 34.38,23.66 32.83,22.11 32.2,21.49 v32.2,21.09 | v38.8,35.16 38.36,35.62 IC3.16
  Bottom 0.229: 38.6,35.16 v38.8,35.16 38.27,35.16 37.58,34.46 35.77,32.66 32.7,32.66 31.8,32.66 31.2,32.06 31.2,26.96 32.6,25.56 32.6,24.36 32.2,23.96 v32.2,21.09 | v46.6,19.86 45.98,20.49 42.62,20.49 41.7,21.41 v41.7,21.86
CS_EXT  (via drill 0.4)
  Top 0.203: IC3.10 38.84,38.62 38.9,38.56 39.6,38.56 40,38.96 40,39.16 40.2,39.36 40.5,39.36 40.9,39.76 40.9,40.96 41.4,41.46 41.4,41.66 41.4,42.16
  Top 0.229: v42.1,42.86 41.4,42.16
  Bottom 0.203: 42.7,45.76 43.4,46.46 43.4,48.56 42.9,49.06
  Bottom 0.229: 42.7,45.76 42.7,43.46 v42.1,42.86
  Bottom 0.254: U$2.1@1 25.41,48.85 25.8,48.46 29.8,48.46 30.4,49.06 42.9,49.06
  Bottom 0.305: U$2.1@1 U$2.1
CSN  (via drill 0.4)
  Top 0.2: R22.1 102.7,40.96 100.5,43.16 90.6,43.16 v89.8,42.36
  Top 0.229: IC3.50 46.66,44.43 v46,43.66 | IC4.2 89.5,30.66 88.2,31.96 81.3,38.86 v81.2,38.86
  Bottom 0.229: v46,43.66 47.5,42.16 50.6,42.16 53.9,38.86 79.8,38.86 | 79.8,38.86 v81.2,38.86 | v81.2,38.86 86.3,38.86 v89.8,42.36 | v81.2,38.86 79.8,38.86
D0  (via drill 0.4)
  Top 0.203: J2.17 52.92,30.91 53.3,30.54 53.55,30.54 v53.58,30.56 | IC3.36 48.49,37.12 v47.85,37.76
  Bottom 0.203: v53.58,30.56 53.6,30.56 55,31.96 55,33.74 52.8,35.94 50.98,37.76 v47.85,37.76
D1  (via drill 0.4)
  Top 0.203: J2.18 53.05,31.41 v53.3,31.66 | v44.1,35.36 44.16,35.3 IC3.26
  Bottom 0.203: v53.3,31.66 52.7,31.66 51.3,30.26 44.7,30.26 43.5,31.46 43.5,34.36 43.6,34.46 44.1,34.96 v44.1,35.36
D2  (via drill 0.4)
  Top 0.203: J2.19 50.85,31.91 v50.1,31.16 | v44.3,31.76 44.66,32.13 IC3.27
  Bottom 0.203: v50.1,31.16 44.8,31.16 v44.3,31.76
D3  (via drill 0.4)
  Top 0.203: J2.20 54.05,32.41 v54.2,32.56 | 45,34.96 45.16,34.8 IC3.28
  Top 0.229: 45,34.96 45,35.86 v45.1,35.96
  Bottom 0.203: v54.2,32.56 51.8,32.56 51.3,32.16 49.1,32.16 47.67,32.16 45.08,34.76 v45.1,35.96
D4  (via drill 0.4)
  Top 0.203: IC3.35 47.82,36.62 47.6,36.84 47.55,36.89 v46.05,38.39
  Top 0.254: J2.21 50.35,32.91 v50.2,33.06
  Bottom 0.254: v50.2,33.06 48.75,33.09 46.08,35.76 46.08,37.66 46.08,38.06 v46.05,38.39
D5  (via drill 0.4)
  Top 0.203: v47.05,36.11 47.57,36.12 48.34,36.12 IC3.34
  Top 0.254: J2.22 53.35,33.41 v53.4,33.46
  Bottom 0.254: v53.4,33.46 52.4,33.46 51.9,33.96 49.17,33.96 v47.05,36.11
D6  (via drill 0.4)
  Top 0.203: J2.23 52.55,33.91 53,34.36 53.9,34.36 55.4,32.86 55.8,32.46 55.8,29.76 55.1,29.06 v54.8,29.06 | IC3.25 43.66,32.53 43.5,32.36 43.5,30.16 v43.6,30.06
  Bottom 0.203: v43.6,30.06 44,29.66 44.2,29.46 52.4,29.46 54.4,29.46 v54.8,29.06
D7
  Top 0.203: J2.24 50.67,34.41 50.45,34.64 50.45,37.51 50.35,37.61 50.34,37.62 IC3.37
D+
  Top 0.254: X1.D+ 63.3,46.81 63.3,45.56 63.1,45.36 R2.2
D-
  Top 0.254: R3.2 63.8,43.76 64.3,44.26 64.3,46.26 64.05,46.51 X1.D-
D/C  (via drill 0.4)
  Top 0.229: IC3.23 42.66,34.83 v42.9,35.06
  Top 0.254: J2.11 48.45,27.91 v48.2,27.66
  Bottom 0.254: v48.2,27.66 47.9,27.36 44.2,27.36 42.8,28.76 42.8,34.96 v42.9,35.06
E
  Top 0.203: J2.16 50.83,30.41 50.65,30.41 50.5,30.26 49.8,30.26 49.6,30.46 49.3,30.76 49.3,35.51 IC3.33
EN2  (via drill 0.4)
  Top 0.203: IC1.15 49.2,15.96 50.2,16.96 50.2,19.51 R24.2
  Top 0.305: SW1.3 65.4,12.57 65.2,12.76 v61.4,13.96 | v58.3,18.96 57.65,19.61 R24.2
  Bottom 0.305: v61.4,13.96 61.4,15.86 v58.3,18.96
GND  (via drill 0.4, 0.6)
  Top 0.2: 105.35,32.32 105.39,32.32 IC4.20 | 105.39,31.13 v105.58,31.04 | v105.58,29.29 105.51,29.19 105.51,29.27 IC4.0 | 105.52,31.14 105.49,31.16 | 106.32,29.19 106.4,29.11 | C15.2 104.3,25.86 | C17.2 104.22,34.59 104.22,34.84 105.6,34.84 105.62,34.86 C13.2
  Top 0.203: IC1.1 46.4,16.16 v45.9,17.16 | v48.7,17.56 48.2,17.06 IC1.17 48.2,15.36 IC1.21 | IC3.12 38.96,37.62 39,37.66
  Top 0.229: 51.35,28.41 52.65,28.41 52.7,28.36 52.7,27.96 52.8,27.86 | IC3.18 40.16,33.53 | J2.3 50.05,23.91 48.9,25.06 | 51.75,23.91 52.65,23.91 53,24.26 | 49.95,22.91 J2.1 52.67,22.91 | 40.16,46.1 39.6,46.66 38.8,46.66 | U1.3 30.48,51.19 30.5,52.96
  Top 0.254: J2.3 51.75,23.91 52.75,23.91 | J2.12 51.35,28.41 50.45,28.41 50.45,28.51 50.3,28.66 | J2.25 54.55,34.91 55.2,34.26 | IC3.57 43.16,44.13 43.1,44.06 | 40.7,43.96 40.16,44.5 IC3.63 40.16,46.1 | IC3.18 40.16,32.63 39.6,32.06 | J2.30 52.75,37.41 v53.33,37.99
  Top 0.3: 105.39,32.32 105.39,31.13 | IC4.17 106.9,31.36 v107.22,31.04 | v105.58,31.04 v105.58,29.29 | 105.51,29.19 106.32,29.19 v107.22,29.29 v107.22,31.04 | v107.22,31.04 105.52,31.14 | IC4.14 107.5,30.66 v107.22,31.04 | 106.4,29.11 IC4.8 | 105.05,31.96 IC4.20
  Top 0.4: 105.05,31.96 100.33,31.96 103.2,34.84 104.22,34.84 | 102.6,24.86 103.8,24.86 | 103.8,24.86 104.4,25.46 C15.2 | C18.2 108,21.06 107.8,20.86 105.5,20.86 104.7,21.66 104.7,23.96 103.8,24.86
  Top 0.5: C14.2 108.4,36.21 v109.05,36.86 | C17.2 104.1,34.66 R25.1 | C20.2 115.9,32.61 v115.85,32.76
  Bottom 0.2: 108.4,32.16 108.4,32.22
  Bottom 0.305: v45.9,17.16 48.3,17.16 v48.7,17.56
  Bottom 0.5: v109.05,36.86 109.05,33.71 108.5,33.16 108.5,32.32 v107.22,31.04
  other vias: 95.7,25.79 93.9,33.46 115.55,25.76 89.4,25.66 91.3,47.66 86.1,27.66 58.1,32.46 103,26.16 115.55,27.76 109.05,19.86 107.05,19.86 105.05,19.86 103.05,19.86 103.05,21.86 103.05,23.86 109.05,40.86 107.05,40.86 107.05,42.86 105.05,42.86 103,32.16 103,34.16 103,36.16 97,40.16 97,36.16 97,22.16 97,20.16 81,20.16 84.4,40.86 69,20.16 70.8,35.26 73.5,35.36 75,20.16 87,20.16 90.2,35.86 93,40.16 93,20.16 90.7,39.76 115.55,23.76 115.55,21.76 115.55,19.76 115.55,17.76 115.55,34.76 115.55,36.76 115.55,38.76 115.55,40.76 115.55,42.76 113.55,19.76 111.55,19.76 113.55,42.76 113.85,32.66 111.85,32.66 113.55,25.76 110.55,25.76 108.55,26.76 109.85,32.66 111.55,42.76 109.55,42.76 47.8,14.96 44.2,41.86 44.5,43.56 51,10.36 49.2,9.86 36.2,11.76 42.25,14.49 42.4,4.96 36,2.66 31.52,20.14 32.7,19.86 41,17.06 40.1,20.56 37.58,20.76 43.9,18.56 43.6,21.56 42,22.96 52.7,21.56 63.5,19.56 57,20.76 58.2,12.36 47.6,22.66 59.5,18.96 33.85,8.94 32.4,12.06 44.9,8.16 56.9,9.66 41.2,24.86 38.8,29.16 38.23,22.44 31.6,36.46 31,37.56 27.6,38.86 28.7,47.64 37.6,46.86 63.8,34.96 63.4,30.66 63.3,27.56 63.5,24.86 63.3,21.66 60.4,14.96 66.8,12.96 62.7,14.76 40,29.06 43.9,39.16 43.7,40.66 45.8,41.96 41.1,43.66 64.3,7.36 52.2,49.26 53.3,46.66 60.7,46.76 49.5,51.71 47,48.06 48.3,46.76 50.6,44.96 31.85,45.04 27.27,58.01 27.5,40.76 20,58.79 30.15,4.99 20.1,2.76 36.2,57.76 36,14.46 15.2,13.16 9,13.16 5.4,9.46 38.6,3.59 46.9,28.26 44.3,28.56 24.5,11.14 10.1,14.36 25.93,16.21 28.73,58.94 15.72,47.01 31.5,25.46 71.9,37.56 73.7,37.56 64,38.06 58.5,38.06 65.2,45.46 23.7,44.06 17.6,46.76 10.82,47.04 6.35,51.24 6.2,56.06 15.88,55.11 22.1,58.34 21.7,52.56 42.08,53.79 37.55,51.89 69.6,45.76 27.98,51.01 38.9,27.96 65.5,50.36 26.2,49.34 19.85,50.16 16,52.66 32.25,56.71 35.1,54.76 33.77,56.09 42,11.26 32.7,6.56 38.3,9.09
  pour Bottom (isolate 0.3): 116,60.16 116,0.16 0.5,0.16 0.5,60.16
  pour Top (isolate 0.3): 116,60.16 116,32.26 107.8,32.26 107.8,29.36 109.7,29.36 109.7,27.66 113.6,27.66 113.6,28.26 116,28.26 116,0.16 0.5,0.16 0.5,60.16
INTN  (via drill 0.4)
  Top 0.203: v40,40.16 38.8,40.16 38.26,39.62 IC3.8 | v33.67,47.11 32.75,48.04 32.1,48.04 U1.7
  Bottom 0.203: v40,40.16 40.3,39.86 40.3,38.66 39.6,37.96 38.8,37.96 38.15,38.61 38.15,40.06 35.08,43.14 34.75,43.14 33.8,44.09 33.8,45.34 33.8,46.99 v33.67,47.11
IREF
  Top 0.254: J2.9 56.65,26.91 57.64,27.9 R1.1
IRQ  (via drill 0.4)
  Top 0.2: 93.5,28.56 103.1,28.56 103.2,28.46 105.3,28.46 105.4,28.36 IC4.6
  Top 0.229: IC3.46 48.34,42.12 47.8,42.66 v47.8,42.96 | v74.4,39.76 85.6,28.56 93.5,28.56
  Bottom 0.229: v47.8,42.96 50.6,42.96 53.8,39.76 v74.4,39.76
LED0  (via drill 0.4)
  Top 0.203: IC3.9 39.04,39.12 v39.2,39.36 | 11.1,56.06 9.75,56.06 R17.1
  Top 0.229: v35.2,43.96 34.58,43.34 27.85,43.34 27.2,43.99 27.2,45.19 26.6,45.79 26.27,45.79 26.25,45.81 25.35,45.81 24.9,45.36 21.4,45.36 17.1,49.66 17.1,50.06
  Top 0.254: 17.1,50.06 11.1,56.06
  Bottom 0.203: v39.2,39.36 39.2,40.06 v35.2,43.96
LED1  (via drill 0.4)
  Top 0.2: R14.1 98.7,50.16
  Top 0.203: 98.7,50.16 96.9,50.16 92.6,54.46 92.3,54.76 88,55.36 83.6,55.66 78.7,55.66 74.7,55.46 68,54.56 61.3,52.86 57.9,51.76 53.8,50.16 50.4,50.16 v47,46.76 | v44.4,47.76 44.66,47.5 IC3.54
  Bottom 0.203: v47,46.76 45.4,46.76 v44.4,47.76
LED2  (via drill 0.4)
  Top 0.203: IC3.11 35.84,38.12 v35.6,37.86 | v30.7,35.36 v27.7,35.36 | v10.6,13.16 9.8,12.36 9.8,4.14 R16.1
  Bottom 0.203: v35.6,37.86 34.7,36.96 33.1,35.36 31,35.36 v30.7,35.36 | v10.6,13.16 12,14.56 13.4,14.56 16.1,14.76 20,15.76 23,17.36 25.6,19.66 26.7,20.86 27.5,22.36 27.7,23.26 v27.7,35.36
LED3  (via drill 0.4)
  Top 0.2: 67.9,45.66 67.9,46.86 64.4,50.36
  Top 0.203: R15.1 98.85,7.51 98.4,7.06 92.7,5.66 86.3,4.56 78.9,4.46 72.5,4.96 69.1,5.66 68.3,6.46 v68.3,8.06 | v67.9,16.76 67.9,45.66 | 64.4,50.36 54.98,47.56 51.8,47.56 v51.1,48.26 | IC3.55 44.16,46.8 43.6,47.36 43.6,48.76 41.9,50.46 41.9,51.06 44.4,53.56 v44.4,53.66
  Bottom 0.203: v68.3,8.06 67.9,8.46 v67.9,16.76 | v51.1,48.26 46.5,52.86 46.5,53.16 46,53.66 v44.4,53.66
MISO  (via drill 0.4)
  Top 0.2: 92.4,29.16 IC4.5
  Top 0.203: 92.4,29.16 86.3,29.16 v73.3,42.46
  Top 0.229: IC3.52 45.66,49.4 v44.5,50.56 | v20.9,55.49 21.65,55.49 v26.5,50.64
  Bottom 0.203: v73.3,42.46 54.5,42.46 46.1,50.56 v44.5,50.56
  Bottom 0.229: v44.5,50.56 44.5,50.06 44.1,49.66 27.1,49.66 26.68,50.09 | 26.68,50.09 26.5,50.26 | 26.5,50.26 v26.5,50.64 | v26.5,50.64 SD1.7 | U$2.4@1 19.91,56.47 v20.9,55.49 | v26.5,50.64 26.5,50.26 | 26.5,50.26 26.68,50.09
  Bottom 0.406: U$2.4 U$2.4@1
MOSI  (via drill 0.4)
  Top 0.2: 92.3,29.66 IC4.4
  Top 0.203: 92.3,29.66 87.7,29.66 v74.2,43.26
  Top 0.229: IC3.53 45.16,48.3 v43,50.46
  Top 0.254: v31.1,54.46 31.1,54.56 30.7,54.96 30.7,56.46 v30.8,56.56
  Bottom 0.203: v74.2,43.26 54.3,43.26 45.9,51.56 44.1,51.56 v43,50.46
  Bottom 0.229: v43,50.46 31.6,50.46 30.9,51.16 SD1.3
  Bottom 0.254: SD1.3 30.91,54.27 v31.1,54.46 | v30.8,56.56 26.9,56.56 26,57.46 23.4,57.46 22.3,56.36 22.3,55.46 20.8,53.96 18.37,53.96 U$2.3@1
  Bottom 0.406: U$2.3 U$2.3@1
N$1
  Top 0.229: 34.9,41.76 35.54,41.12 IC3.5
  Top 0.254: C9.2 32.6,40.51 Q1.3 32.6,41.46 32.9,41.76 34.9,41.76
N$2
  Top 0.203: IC1.18 47.8,18.66 48,18.86 48,19.36 R19.2
N$3
  Top 0.229: R20.2 34.25,39.01 Q1.1
  Top 0.254: C10.2 34,37.11 Q1.1
N$4
  Top 0.2: R17.2 6.95,54.96 4.31,54.96 LED0.A
N$5
  Top 0.2: R16.2 8.2,4.06
  Top 0.3: 8.2,4.06 7.8,4.06 6.3,5.56 4.11,5.56 LED2.A
N$6
  Top 0.2: LED3.A 105,13.16 102.3,13.16 100.4,11.26 100.4,10.16 R15.2
N$7
  Top 0.203: IC1.13 50.1,14.96 50.3,15.16 51.5,15.16 51.6,15.26 R9.1
  Top 0.305: R9.1 51.8,15.76 C3.1 R12.2 55,15.86 56,15.86 | 56,15.86 56.1,15.86 C7.2 | R8.2 56.4,14.66 56.1,14.96 56,15.26 56,15.86
N$8
  Top 0.406: F1.1 66.2,17.16 67,17.96 67,44.76 67,45.16 64.33,47.84 X1.VUSB
N$9
  Top 0.2: LED1.A 105,47.26 102.2,47.26 100.4,49.06 100.4,50.16 R14.2
N$10
  Top 0.2: 106.45,23.06 Q2.1 106.45,23.16 105.7,23.16 105.3,23.56 105.3,25.56 106.9,27.16 IC4.9
  Top 0.4: C18.1 106.5,22.06 Q2.1
N$11
  Top 0.2: Q2.3 108.6,24.91 108.6,25.36 107.4,26.56 IC4.10
  Top 0.4: C19.1 108.95,24.56 Q2.3
N$12
  Top 0.6: C16.1 C20.1
  Top 0.8: C20.1 117.75,30.46 ANT.1
N$13
  Top 0.305: C3.2 53.5,13.66 R18.1
N$14
  Top 0.254: D2.A 62.38,36.26 R10.2
N$15  (via drill 0.4)
  Top 0.203: v39.3,36.56 38.74,37.12 IC3.13 35.26,37.12 34.8,36.66 34.8,35.86 34.6,35.66 C25.1
  Top 0.229: R4.1 35.35,22.06 v34.1,22.06
  Bottom 0.203: v39.3,36.56 39.6,36.26 39.6,34.86 38.8,34.06 38.4,33.66 38.3,33.56 34.3,29.56 34.3,22.36 34.2,22.26 v34.1,22.06
N$16
  Top 0.305: C4.2 53.4,17.56 R12.1
N$17
  Top 0.203: IC1.14 49.7,15.36 50.2,15.86 50.2,16.26 50.7,16.76 50.7,17.26 50.9,17.46 C4.1
  Top 0.305: C7.1 57.2,18.56 56.9,18.86 51.9,18.86 51.5,18.46 C4.1
N$18
  Top 0.203: IC1.10 48.7,13.56
  Top 0.305: 48.7,13.56 48.7,12.91 L6.P$1
N$19
  Top 0.229: IC3.31 46.66,29.82
  Top 0.254: 46.66,29.82 C40.1
N$20
  Top 0.229: IC3.47 50.72,42.62 51.37,43.27 C41.2
N$21  (via drill 0.4)
  Top 0.203: 35.4,42.86 27.5,42.86 26.5,43.86 26.3,44.06 v26.3,44.86
  Top 0.229: IC3.3 36.14,42.12 35.4,42.86
  Bottom 0.203: 26.2,46.66 26.3,46.56 v26.3,44.86
  Bottom 0.229: 26.2,46.66 25.2,47.66 PAD1.1
N$22
  Top 0.203: IC1.9 48.2,12.76
  Top 0.305: 48.2,12.76 48.2,10.46 L6.P$2
N$23  (via drill 0.4)
  Top 0.229: IC3.4 35.84,41.62 35.1,42.36 28.6,42.36 28.3,42.06 27.2,42.06 25.2,44.06 v25.2,44.16
  Bottom 0.229: v25.2,44.16 25.2,45.46 24.9,45.76 PAD2.1
N$24
  Top 0.406: L5.P$2 39.98,13.06 IC2.1 37.15,15.46 D1.A
N$25  (via drill 0.4)
  Top 0.203: IC1.3 45.4,14.96 44.8,15.56 v44.4,15.56 43.9,15.56 43.7,15.76 R30.1 | IC1.12 50,14.56 v50.3,14.26
  Bottom 0.305: 50.1,14.26 v50.3,14.26 47.8,11.76 45.5,11.76 45,12.26 45,14.96 v44.4,15.56
N$26
  Top 0.406: IC2.3 R13.2 32.5,13.06 32.1,13.46 32.1,15.36 31.4,16.06 R5.1 C11.2
N$27
  Top 0.203: IC1.5 45.8,14.16 45.5,13.86 45.5,13.46 45.3,13.26 45.3,12.36 45.48,12.11 R31.2
N$28
  Top 0.229: IC3.6 35.91,40.62 R20.1
N$29
  Top 0.229: D3.C 37.41,45.55 IC3.1
N$30
  Top 0.406: IC2.4 35.25,8.84 R11.1
N$70
  Top 0.2: IC4.19 105.9,33.11 105.65,33.36 104.45,33.36 104.2,33.11 C17.1
N$71  (via drill 0.4)
  Top 0.2: v106.9,36.26 R25.2 | IC4.16 v107.4,33.66
  Bottom 0.2: v106.9,36.26 106.9,34.16 v107.4,33.66
N$73
  Top 0.3: 111.45,27.76 L4.2 | IC4.11 109.1,29.16 109.2,29.06 109.2,27.46 109.8,26.86 C22.1
  Top 0.4: C21.1 111.45,27.76
  Top 0.5: C22.1 C21.1
N$78
  Top 0.3: IC4.12 109.6,29.66 110.05,29.21 L2.2
  Top 0.6: L2.2 L4.1
N$79
  Top 0.3: 110.15,30.36 L2.1 110.05,30.51 109.7,30.16 IC4.13
  Top 0.6: L2.1 111,30.51 L3.1
N$80
  Top 0.6: L3.2 C16.2
R/W  (via drill 0.4)
  Top 0.203: v46.2,39.76 46.84,39.12 IC3.40 | J2.15 52.65,29.91 52.8,29.76 54.1,29.76 v54.8,30.46
  Bottom 0.203: v54.8,30.46 55.7,31.36 55.7,33.96 52.4,37.36 52.4,38.76 51.6,39.56 46.4,39.56 v46.2,39.76
REG_EN_  (via drill 0.4, 0.6)
  Top 0.229: IC3.15 36.66,36.12 36,35.46 v36,34.36 | v32.73,8.19 34.4,6.51 R26.1
  Top 0.406: R26.1 36.3,6.91 Q3.1
  Bottom 0.203: 31.5,33.26 32.6,34.36 v36,34.36
  Bottom 0.229: 31.5,33.26 30.6,32.36 30.6,12.11 32.75,9.96 32.73,9.94 v32.73,8.19
RES  (via drill 0.4)
  Top 0.229: IC3.22 42.16,28.9 v42,28.76
  Top 0.254: J2.10 50.25,27.41 v49.3,26.46
  Bottom 0.254: v49.3,26.46 43.9,26.46 42.1,28.36 42.1,28.66 v42,28.76
RESETN
  Top 0.203: U1.6 32.08,48.66 32.3,48.89 R27.1
SCK  (via drill 0.4)
  Top 0.2: 92.2,30.16 IC4.3
  Top 0.203: 92.2,30.16 88.5,30.16 v74.1,44.56
  Top 0.229: IC3.51 46.16,52.1 v45.5,52.76
  Bottom 0.2: SD1.5
  Bottom 0.203: v74.1,44.56 53.7,44.56 v45.5,52.76
  Bottom 0.229: v45.5,52.76 35.8,52.76 32.83,55.74 29.75,55.74 28.7,54.64 28.7,54.06 SD1.5
  Bottom 0.254: U$2.2@1 20.57,51.39 21.6,50.36 22.3,50.36 23.6,50.36 24.3,51.06 24.3,53.66 24.8,54.16 28.6,54.16 28.7,54.06
  Bottom 0.406: U$2.2 U$2.2@1
SCL
  Top 0.203: IC3.58 42.66,47 42.3,47.36 41.75,47.91 41.75,48.46 40.65,49.56 40.65,49.81 40.65,51.04
  Top 0.229: 40.65,51.04 40.65,51.39 39.35,52.69 38.31,53.73 | 38.31,53.73 33.85,58.19 29.73,58.19 29.25,57.71 29.25,50.74 29.85,50.14 U1.5 | R29.1 38.55,53.96 38.31,53.73
SCL2  (via drill 0.4)
  Top 0.229: IC3.29 45.66,32.63 45.3,32.26 45.3,27.36 45,27.06 39.9,27.06 38.4,25.46 33.3,25.46 28.1,20.36 26.5,20.36 23.5,17.36 v23.5,16.56
  Top 0.279: R23.2 20.57,9.91 23.7,13.04 23.7,14.56 23.35,14.91 23.35,16.41 v23.5,16.56
  Bottom 0.229: v23.5,16.56 23.2,16.26 22.3,16.26 20.3,15.16 17.28,14.35 16.6,14.16 12.3,13.96 11.6,13.26 11.6,12.36 9.2,9.96 6.9,9.96 6.5,9.56 6.5,8.26 7.1,7.66 7.8,7.66 8.06,7.41 U$1.3@1
  Bottom 0.305: U$1.3@1 U$1.3
SDA
  Top 0.203: IC3.59 42.16,46.3 41.2,47.26 41.2,47.99 40.15,49.04 40.15,50.99
  Top 0.229: 40.15,50.99 39.05,52.09 38.09,53.05 | 38.09,53.05 33.55,57.59 30.02,57.59 29.82,57.39 29.82,51.01 30.15,50.69 U1.4 | R28.1 37.73,52.69 38.09,53.05
SDA2  (via drill 0.4)
  Top 0.229: IC3.30 46.16,32.33 45.9,32.06 45.9,27.06 45.3,26.46 40.2,26.46 38.7,24.86 33.5,24.86 29.3,20.76 28.2,19.76 26.8,19.76 24.4,17.36 v24.4,15.16
  Top 0.279: R21.2 21.95,10.21 23.6,11.86 24.4,12.66 v24.4,15.16
  Bottom 0.229: v24.4,15.16 19.7,10.46 19.7,9.86 19.7,9.16 19.47,8.93 U$1.2
  Bottom 0.305: U$1.2@1 U$1.2
SS3  (via drill 0.4)
  Top 0.203: IC3.62 40.66,46.3 39.1,47.8 39.1,50.76 v38.55,51.31
  Bottom 0.203: 32.2,51.26 32,51.46 SD1.2
  Bottom 0.229: v38.55,51.31 38.27,51.04 36.6,51.04 32.42,51.04 32.2,51.26
SW2  (via drill 0.4, 0.6)
  Top 0.203: 41.16,46.5 40.38,47.29 v40.38,47.64
  Top 0.229: 41.16,46.5 IC3.61 IC3.60
  Top 0.279: SW2.1 32.05,5.44 v31.4,6.09
  Bottom 0.203: v40.38,47.64 40.1,47.91 32.45,47.91
  Bottom 0.254: 29.95,31.96 29.9,34.84 29.65,35.09 29.65,45.11 32.45,47.91
  Bottom 0.279: v31.4,6.09 31.4,9.84 29.9,11.34 29.95,31.96
SW3  (via drill 0.4, 0.6)
  Top 0.203: IC3.56 43.66,46.5 43.1,47.06 43.1,47.71 v42.62,48.19
  Top 0.279: SW3.1 29.78,9.94 v28.57,9.41
  Bottom 0.203: v42.62,48.19 42.33,48.49 32.35,48.49
  Bottom 0.254: 32.35,48.49 31.98,48.49 28.93,45.44 28.93,32.24 29.32,31.89
  Bottom 0.279: v28.57,9.41 28.8,9.59 29.25,10.04 29.32,31.89
SW4  (via drill 0.4, 0.6)
  Top 0.203: IC3.14 35.84,36.62 35.6,36.36 35.42,36.19 35.42,35.04 34.9,34.51 34.9,33.64 34.62,33.36 32.52,33.36 30.43,31.26 v28.52,31.26
  Top 0.279: SW4.1 27.95,14.09 v28.18,13.86
  Bottom 0.279: v28.18,13.86 28.18,13.94 28.52,14.29 28.52,30.89 v28.52,31.26
SWITCHN
  Top 0.203: IC3.2 36.44,42.62 36.3,42.76 36.2,42.86 36.2,43.76 36.2,43.96 36.2,44.31 34.2,46.31 33.98,46.31 33.1,46.31 31.98,47.44
  Top 0.229: 31.98,47.44 U1.8
USB_DM
  Top 0.229: R3.1 58.1,43.76 56.5,43.76 55.1,42.36 54.1,41.36 51.6,41.36 51.36,41.12 IC3.44
USB_DP
  Top 0.229: R2.1 58.4,45.36 57.2,45.36 54.9,43.06 53.8,41.96 51.3,41.96 50.96,41.62 IC3.45
VBREF
  Top 0.254: J2.5 54.45,24.91 58.99,20.37 C5.2
VCOMH  (via drill 0.5)
  Top 0.254: J2.28 55.15,36.41 v55.6,36.86
  Top 0.406: C29.+ 71.53,48.8 C28.+ 71.49,39.06 v69.6,37.16
  Bottom 0.406: v55.6,36.86 56,36.86 56.3,37.16 v69.6,37.16
VLIPO  (via drill 0.4, 0.5, 0.6)
  Top 0.203: IC1.2 45.8,15.36 45.7,15.46 | IC1.8 47.6,13.56 IC1.7 47.6,13.76
  Top 0.229: v32.2,31.56 32.2,32.06 32.8,32.66 35.3,32.66 35.75,33.11 37.3,33.11 R6.2 37.35,33.91 37.7,34.26 39.1,34.26 39.7,34.86 39.7,35.66 41.9,37.86 v41.9,38.26 | v36.2,46.96 36.2,47.76 D3.A
  Top 0.254: 47.6,13.16 47.6,13.56 47.6,13.76
  Top 0.305: 47.6,13.16 47,12.56 46.4,12.56 v46.1,12.86 | 45.7,15.46 v44.1,17.06 | SW1.2 62.98,10.04 v62.3,9.36 | v33.7,18.99 34.23,18.99 34.52,18.69 40.4,18.69 40.8,18.29 42.27,18.29 C1.1
  Top 0.406: v44.1,17.06 42.6,17.06 42.3,17.36 C1.1 | v37.12,3.59 37.3,3.71 Q3.2 36.1,5.01 R26.2
  Top 0.61: X1_.3 v32.2,27.56
  Bottom 0.229: v32.2,31.56 v32.2,27.56 | v41.9,38.26 41.9,40.66 40.7,41.86 40.6,41.86 39.7,41.86 38.5,43.06 38.5,44.46 36.6,46.36 36.2,46.76 v36.2,46.96
  Bottom 0.305: v33.7,18.99 33.7,20.16 33.2,20.66 33.2,22.36 33.7,22.86 33.7,26.06 v32.2,27.56 | v62.3,9.36 62.3,9.76 60.7,11.46 52.5,11.46 51.7,12.26 51.7,14.46 51,15.16 49.8,15.16 47.5,12.86 v46.1,12.86 46.1,15.66 44.7,17.06 v44.1,17.06 44.1,16.99 43.23,16.11 43.12,9.59 v37.12,3.59
VOLTAGE
  Top 0.229: IC3.17 38.86,33.37 R6.1 38.65,31.96 C27.2
VPA
  Top 0.254: J2.6 55.25,25.41 58.48,22.18 C6.2
VPB
  Top 0.254: J2.7 56.25,25.91 58.14,24.03 C24.2
VPC
  Top 0.254: J2.8 57.55,26.41 58.03,25.93 C26.2
VREGIN
  Top 0.406: L5.P$1 40.4,10.74 40.7,10.56 40.7,9.66 C32.+ 43.2,9.66 C33.1 | L5.P$1 37.1,10.74 | IC2.5 37.1,10.09 37.1,10.74 | 40.7,8.76 C31.+ 40.7,8.76 | 40.7,8.76 40.6,8.76 | 40.6,8.76 40.7,8.76 | 40.7,8.76 40.7,10.36 40.7,10.74 L5.P$1 | Q3.3 39.3,8.76 40.6,8.76 | 40.6,8.76 40.7,8.76 | 40.7,8.76 40.6,8.76 | 40.6,8.76 40.7,8.76 | 37.1,10.74 37.05,9.64 R11.2
VSL
  Top 0.254: J2.26 58.05,35.41 58.97,34.5 R10.1

### Text on the board
tPlace: lun1k v1.2 | seb@exse.net | STM32F4 | + | A | wakeup | B | ON | ESC | bootloader
bPlace: MISO | MOSI | SCK | C2 | C14 | C15 | GND | SDA/RX/B11 | SCL/TX/B10 | 3.3V
tNames: smaller packakce | smaller packakce